# Altium schematic sheet LVR - AMS.SchDoc
size A4
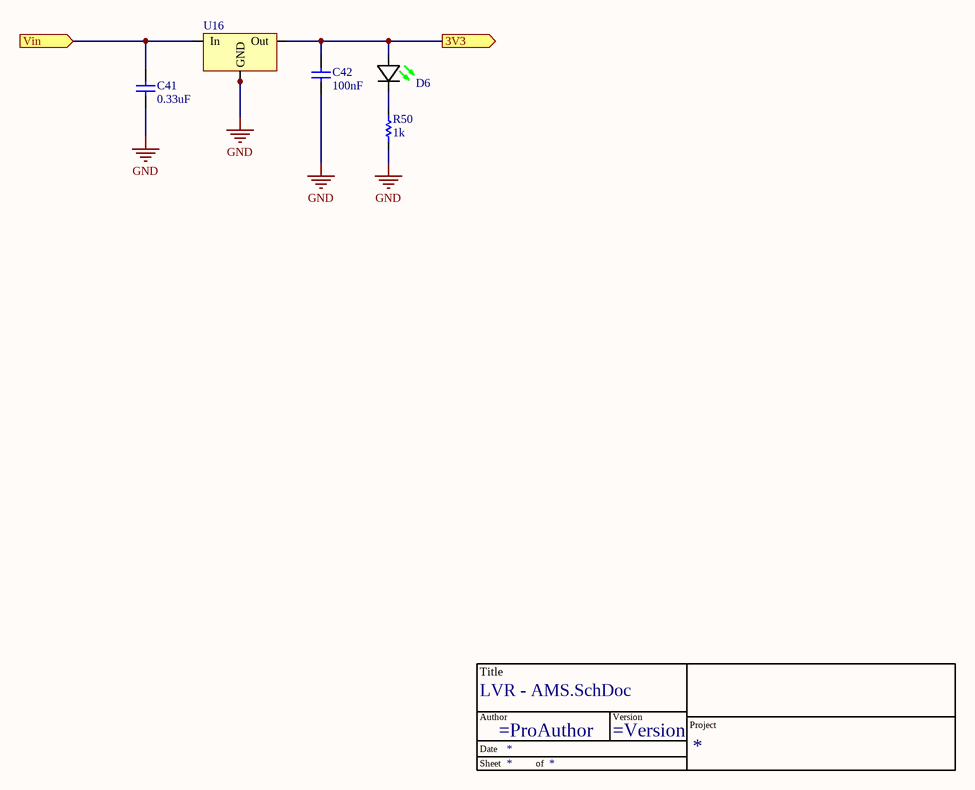
[diagram p0: LVR - AMS.SchDoc]

## Parts
*?  TitleBlock  (value not drawn)  (graphical)
C41  value 0.33uF  [C_0603]  (hidden comment: 885012206074)
C42  value 100nF  [C_0603]  (hidden comment: C0603C104K3RAC7013)
D6  150060GS55040  [LED (0603)]  (value not drawn)
R50  value 1k  [R-0603]  (hidden comment: CR0603AFX-1001ELF)
U16  ZSR330GTA  [ZSR330GTA]  (value not drawn)

## Ports
3V3 (out), Vin (in)

## Nets
GND: C41.1 C42.1 R50.1 U16.2(GND) U16.4(GND)
3V3: C42.2 D6.2(A) U16.1(Out) ; port 3V3
Vin: C41.2 U16.3(In) ; port Vin
NetD6_1: D6.1(K) R50.2

## Notes on the sheet
- (in symbol TitleBlock) Title; Author; Version; Project; Date; Sheet; of

## Library data of the parts
C41 C42 = Capacitor: ComponentLink1Description: New link; ComponentLink1URL: *
D6 = 150060GS55040: LED GREEN DIFFUSED 0603 SMD; Manufacturer: Wurth Electronics; Lens Style: Flat; Luminous Intensity: 430mcd; Forward Voltage: 3.2V; Test Current: 20mA; Viewing Angle: 140°; Dominant Wavelength: 525nm; Lens Size: 0.8mm; Supplier 1: Mouser; Manufacturer Part Number: 150060GS55040; RoHS: No; Category: LEDs; Stock 1: 3998; Pricing 1: 1=0.23000, 10=0.21000, 50=0.21000, 100=0.19000, 1000=0.15200, 10000=0.13200 (USD); Mount: Surface Mount; Case/Package: 0603; Color: Green; Case Code (Imperial): 0603; Case Code (Metric): 1608; Packaging: Cut Tape; Lens Transparency: Diffused; Length: 1.6mm; Width: 0.8mm; Height: 0.5mm; RoHS Compliant: No; ComponentLink1URL: http://www.farnell.com/datasheets/2621642.pdf?src-supplier=Farnell; ComponentLink1Description: http://www.farnell.com/datasheets/2621642.pdf?src-supplier=Farnell; ComponentLink2URL: http://katalog.we-online.de/pbs/datasheet/150060GS55040.pdf?src-supplier=Digi-Key; ComponentLink2Description: http://katalog.we-online.de/pbs/datasheet/150060GS55040.pdf?src-supplier=Digi-Key; ComponentLink3URL: https://www.we-online.de/web/en/index.php/download/media/07_electronic_components/download_center_1/application_notes_berichte/ano002_leds___the_future_of_horticultural_lighting/ANO002b_EN_LEDs_The_Future_of_Horticultural_Lighting.pdf?src-supplier=Digi-Key; ComponentLink3Description: https://www.we-online.de/web/en/index.php/download/media/07_electronic_components/download_center_1/application_notes_berichte/ano002_leds___the_future_of_horticultural_lighting/ANO002b_EN_LEDs_The_Future_of_Horticultural_Lighting.pdf?src-supplier=Digi-Key; ComponentLink4URL: https://katalog.we-online.de/pbs/datasheet/150060GS55040.pdf?src-supplier=Digi-Key; ComponentLink4Description: https://katalog.we-online.de/pbs/datasheet/150060GS55040.pdf?src-supplier=Digi-Key; ComponentLink5URL: http://www.farnell.com/datasheets/2621642.pdf?src-supplier=Newark; ComponentLink5Description: http://www.farnell.com/datasheets/2621642.pdf?src-supplier=Newark; Supplier Part Number 1: 710-150060GS55040
R50 = Resistor
U16 = ZSR330GTA: Standard Regulator Pos 3.3V 0.2A 4-Pin(3+Tab) SOT-223 T/R; Manufacturer: Diodes Zetex; Output Type: Fixed; Max Output Current: 200mA; Number of Outputs: 1; Max Input Voltage: 20V; Min Input Voltage: 5.3V; Max Power Dissipation: 2W; Polarity: Positive; Quiescent Current: 600uA; Accuracy: 2.5%; Power Supply Rejection Ratio (PSRR): 64dB; Supplier 1: RSComponents; Manufacturer Part Number: ZSR330GTA; RoHS: No; Category: Voltage Regulators - Linear; Stock 1: 90; Pricing 1: 5=1.13900, 25=0.99200, 50=0.94200, 250=0.74500, 500=0.66700, 5=0.82000, 25=0.71400, 50=0.67800, 250=0.53600, 500=0.48000 (USD); Mount: Surface Mount; Case/Package: SOT-223; Weight: 0.000282oz; Min Operating Temperature: -55°C; Max Operating Temperature: 125°C; Output Voltage: 3.3V; Output Voltage Accuracy: 2.5%; Tolerance: 2.5%; Power Rating: 2W; Packaging: Tape and Reel; Output Current: 200mA; Package Quantity: 1000; Number of Regulators: 1; Reference Voltage: 3.3V; Power Dissipation: 2W; Length: 6.7mm; Width: 3.7mm; Height: 1.65mm; Radiation Hardening: No; REACH SVHC: No SVHC; Lead Free: Lead Free; ComponentLink1URL: https://datasheet.ciiva.com/4882/zsr-91730-4882775.pdf?src-supplier=Mouser; ComponentLink1Description: https://datasheet.ciiva.com/4882/zsr-91730-4882775.pdf?src-supplier=Mouser; ComponentLink2URL: https://datasheet.ciiva.com/8240/zsr-8240251.pdf?src-supplier=Avnet; ComponentLink2Description: https://datasheet.ciiva.com/8240/zsr-8240251.pdf?src-supplier=Avnet